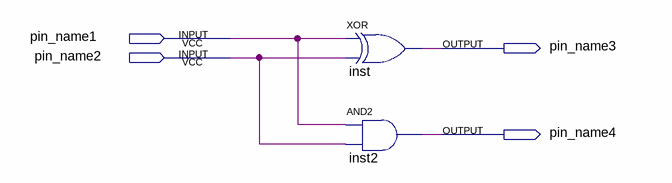
[diagram p0: schematic sheet]
// Quartus schematic Project1009.bdf as structural Verilog: 2 symbols, 4 pins
module Project1009 (
  input  pin_name1,
  input  pin_name2,
  output pin_name3,
  output pin_name4
);

  xor inst (pin_name3, pin_name1, pin_name2);
  and inst2 (pin_name4, pin_name1, pin_name2);
endmodule
